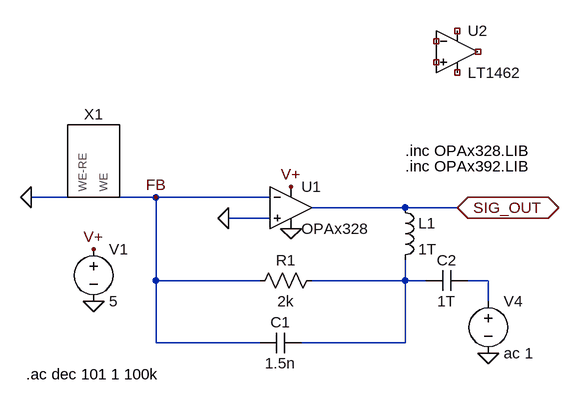
[diagram p0: schematic OPA2392_Trans_Amp AC.asc]
OPA2392_Trans_Amp AC.asc, the LTspice schematic file:
Version 4
SHEET 1 1004 680
WIRE -80 144 -160 144
WIRE 32 144 -48 144
WIRE 208 144 32 144
WIRE 416 160 272 160
WIRE 496 160 416 160
WIRE 208 176 144 176
WIRE 32 272 32 144
WIRE 192 272 32 272
WIRE 416 272 416 240
WIRE 416 272 272 272
WIRE 448 272 416 272
WIRE 544 272 512 272
WIRE 544 304 544 272
WIRE 32 368 32 272
WIRE 192 368 32 368
WIRE 416 368 416 272
WIRE 416 368 256 368
FLAG 496 160 SIG_OUT
IOPIN 496 160 BiDir
FLAG -64 304 0
FLAG -64 224 V+
FLAG 32 144 FB
FLAG 240 192 0
FLAG 240 128 V+
FLAG -160 144 0
FLAG 144 176 0
FLAG 544 384 0
SYMBOL res 288 256 R90
WINDOW 0 0 56 VBottom 2
WINDOW 3 32 56 VTop 2
SYMATTR InstName R1
SYMATTR Value 2k
SYMBOL voltage -64 208 R0
WINDOW 123 0 0 Left 0
WINDOW 39 0 0 Left 0
SYMATTR InstName V1
SYMATTR Value 5
SYMBOL Randles_Circuit -64 80 R90
WINDOW 0 -48 0 VBottom 2
SYMATTR InstName X1
SYMBOL OpAmps\\opamp2 240 96 R0
SYMATTR InstName U1
SYMATTR Value OPAx328
SYMBOL cap 256 352 R90
WINDOW 0 0 32 VBottom 2
WINDOW 3 32 32 VTop 2
SYMATTR InstName C1
SYMATTR Value 1.5n
SYMATTR SpiceLine V=50
SYMBOL ind 400 144 R0
SYMATTR InstName L1
SYMATTR Value 1T
SYMBOL cap 512 256 R90
WINDOW 0 0 32 VBottom 2
WINDOW 3 32 32 VTop 2
SYMATTR InstName C2
SYMATTR Value 1T
SYMBOL voltage 544 288 R0
WINDOW 123 0 0 Left 0
WINDOW 39 0 0 Left 0
SYMATTR InstName V4
SYMATTR Value ac 1
SYMBOL OpAmps\\LT1462 496 -144 R0
SYMATTR InstName U2
TEXT 416 96 Left 2 !.inc OPAx392.LIB
TEXT -168 416 Left 2 !.ac dec 101 1 100k
TEXT 416 72 Left 2 !.inc OPAx328.LIB

The netlist it stands for:
* OPA2392_Trans_Amp AC.asc
R1 N001 FB 2k
V1 V+ 0 5
XX1 FB 0 Randles_Circuit  ; pins WE WE-RE
XU1 0 FB V+ 0 SIG_OUT OPAx328  ; pins In+ In- V+ V- OUT
C1 N001 FB 1.5n V=50
L1 SIG_OUT N001 1T
C2 N002 N001 1T
V4 N002 0 ac 1
XU2 NC_01 NC_02 NC_03 NC_04 NC_05 LT1462  ; pins In+ In- V+ V- OUT
.inc OPAx392.LIB
.ac dec 101 1 100k
.inc OPAx328.LIB
.lib LTC.lib
.backanno
.end

* Results of the author's LTspice run, read from the files saved beside the schematic
* Operating Point, zero values left out:
*   V(v+) = 5 V
*   I(C2) = -2.512 µA
*   I(L1) = 2.512 µA
*   I(R1) = 32.19 pA
*   I(V1) = -3.803 mA
*   I(V4) = 2.512 µA
*   Ix(x1:WE) = 44.79 pA
*   Ix(x1:WE-RE) = -44.79 pA
*   Ix(u1:IN+) = -12.4 pA
*   Ix(u1:IN-) = -12.6 pA
*   Ix(u1:VCC) = 3.803 mA
*   Ix(u1:VEE) = -3.8 mA
*   Ix(u1:OUT) = -2.512 µA
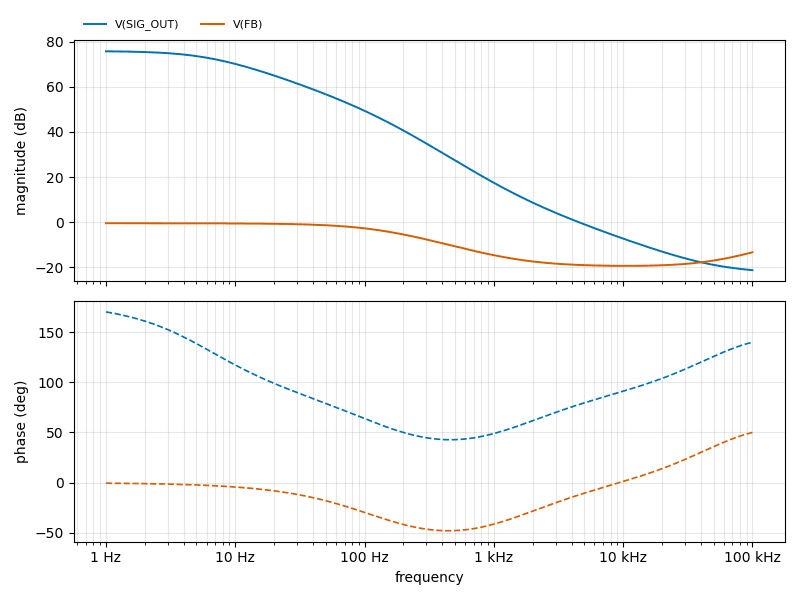
[diagram p1: AC Analysis of OPA2392_Trans_Amp AC.asc, plotted from the saved traces]
* AC Analysis, 1 run:
*   V(SIG_OUT): 75.71 dB at 1 Hz, -21.25 dB at 100 kHz, peak 75.71 dB at 1 Hz, 3 dB below the peak at 6.244 Hz
*   V(FB): -0.45 dB at 1 Hz, -13.33 dB at 100 kHz, peak -0.45 dB at 1 Hz, 3 dB below the peak at 125.6 Hz